# Altium schematic sheet Needle_main.SchDoc: ESP32_IMU_SPI_BOARD
size A3; Author: Alfred; CompanyName: worldangle.cn; DrawnBy: Alfred; DocumentNumber: 1; SheetNumber: 1; SheetTotal: 1
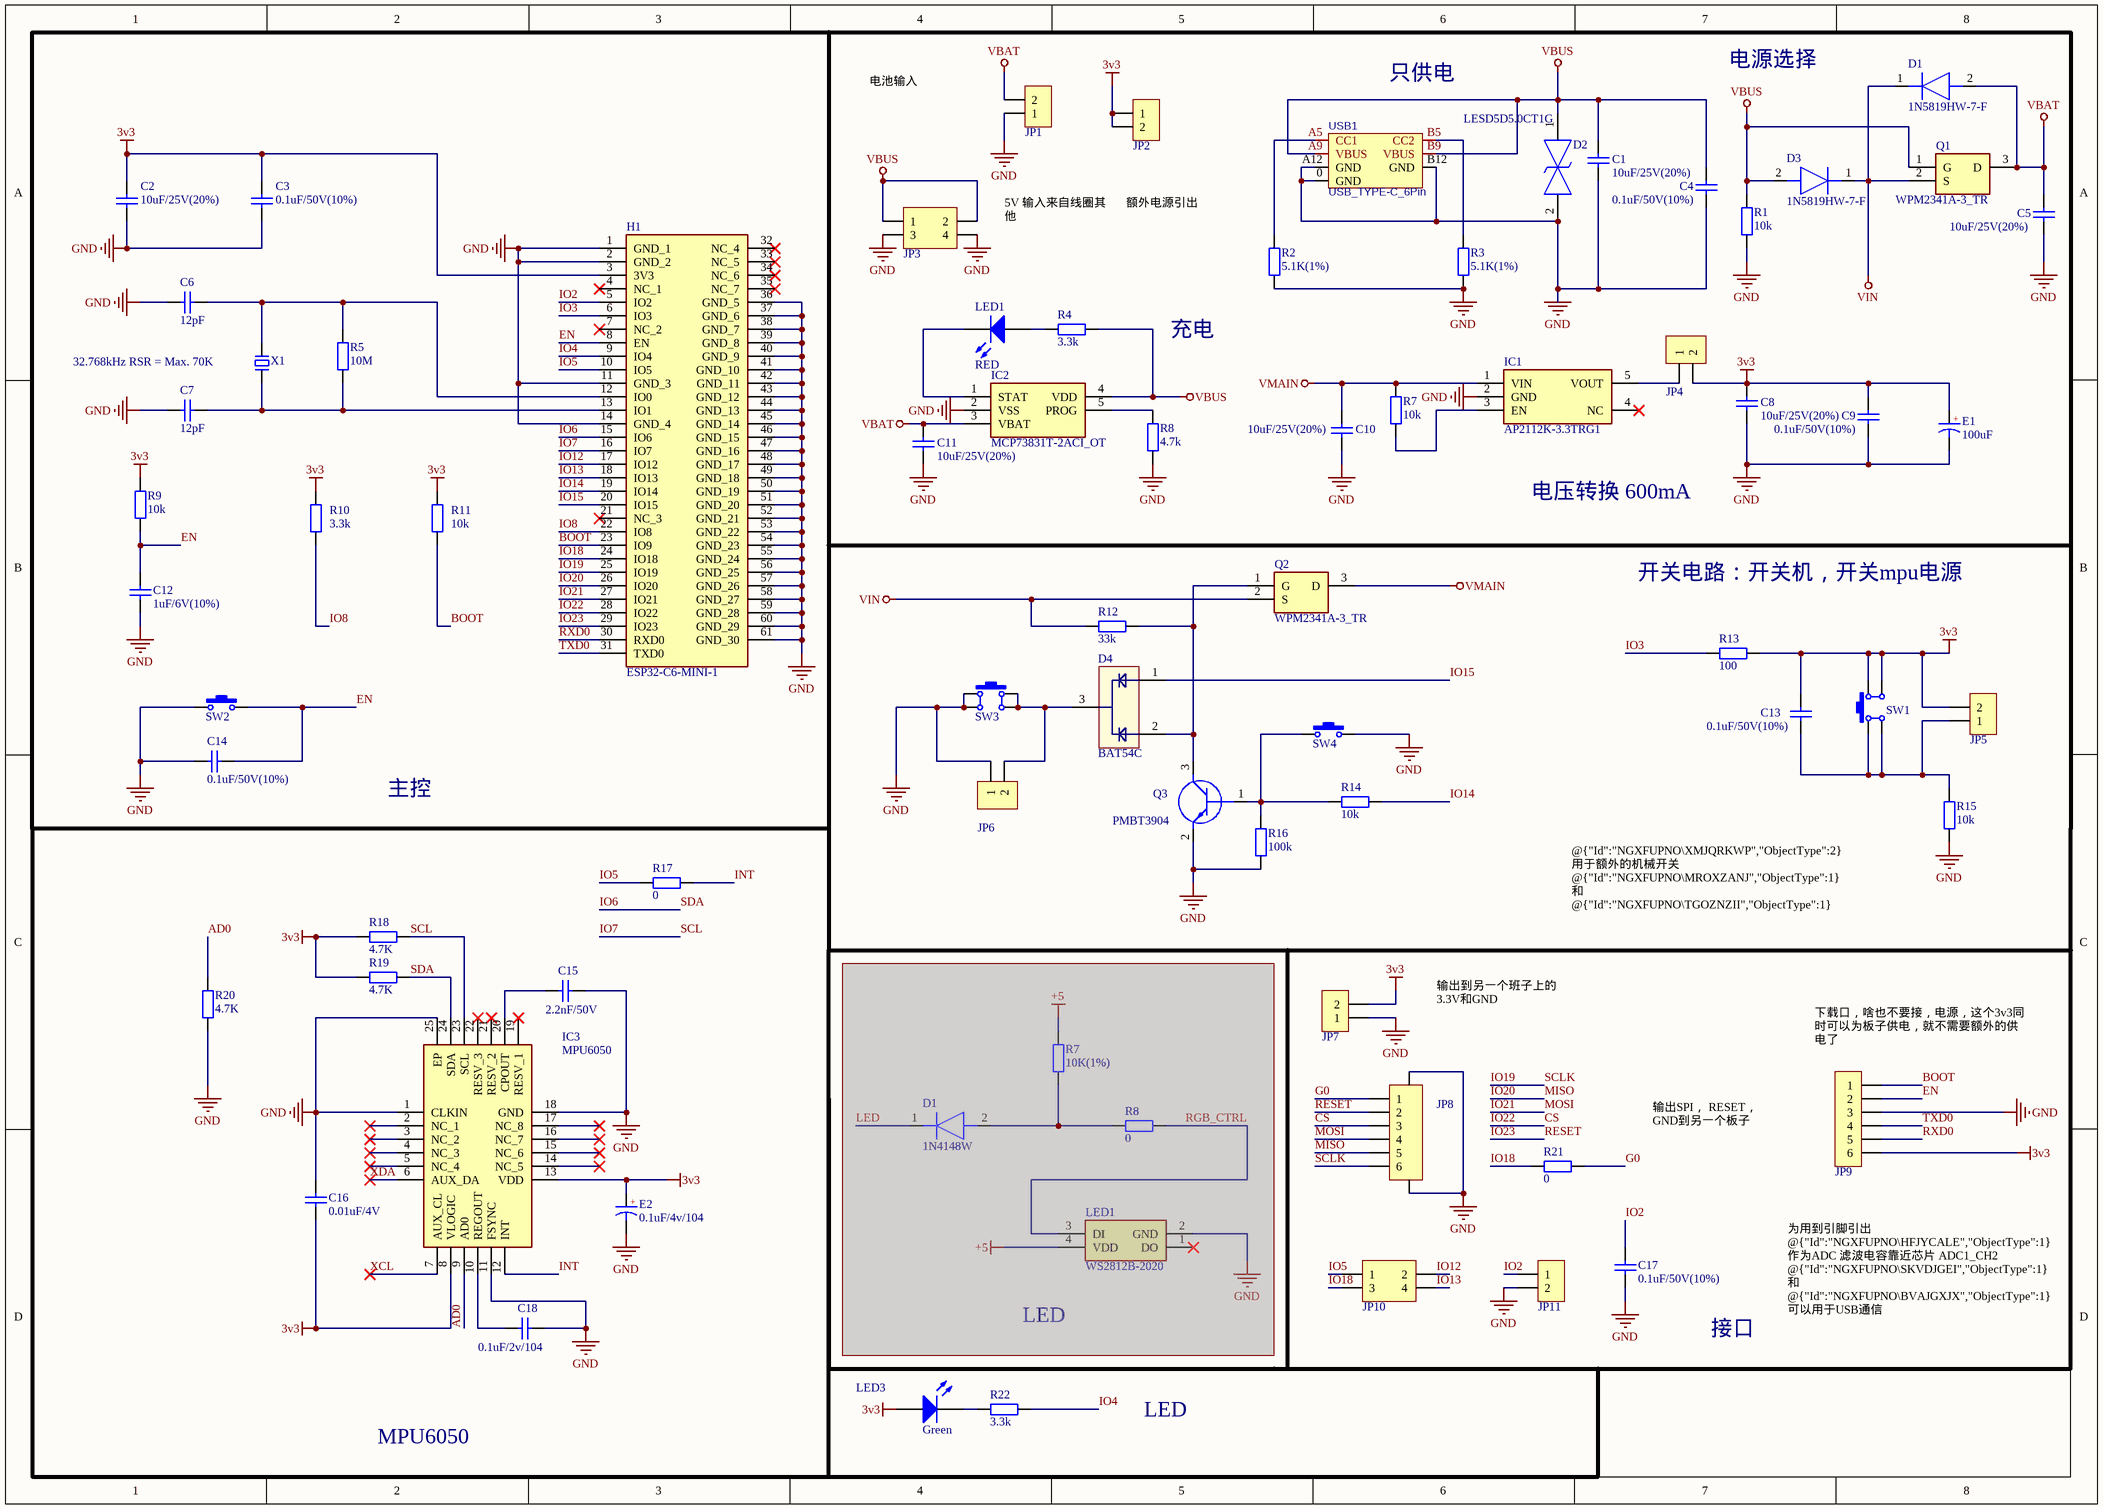
[diagram p0: Needle_main.SchDoc]

## Parts
(Parts that share a designator on the sheet are numbered #1, #2 ... from top to bottom, then left to right.)
C1  10uF/25V(20%)  [C0603_L]
C2  10uF/25V(20%)  [C0402_L]
C3  0.1uF/50V(10%)  [C0402_L]
C4  0.1uF/50V(10%)  [C0603_L]
C5  10uF/25V(20%)  [C0603_L]
C6  12pF  [C0402_L]
C7  12pF  [C0402_L]
C8  10uF/25V(20%)  [C0603_L]
C9  0.1uF/50V(10%)  [C0603_L]
C10  10uF/25V(20%)  [C0805_L]
C11  10uF/25V(20%)  [C0805_L]
C12  1uF/6V(10%)  [C0402_L]
C13  0.1uF/50V(10%)  [C0402_L]
C14  0.1uF/50V(10%)  [C0402_L]
C15  2.2nF/50V  [C0402_L]
C16  0.01uF/4V  [C0402_L]
C17  0.1uF/50V(10%)  [C0805_L]
C18  0.1uF/2v/104  [C0402_L]
D1#1  1N5819HW-7-F  [SOD3716X125N]
D1#2  1N4148W  [SOD3716X125N]  (masked out: inside a compile mask, not in the netlist)
D2  LESD5D5.0CT1G  [LESD5D50CT1G]
D3  1N5819HW-7-F  [SOD3716X125N]
D4  BAT54C  [SOT23-3N]
E1  100uF  [C_3216]
E2  0.1uF/4v/104  [C_3216]
H1  ESP32-C6-MINI-1  [ESP32C6MINI1]
IC1  AP2112K-3.3TRG1  [SOT95P285X140-5N]
IC2  MCP73831T-2ACI_OT  [SOT95P270X145-5N]
IC3  MPU6050  [MPU6050]
JP1  HDR-1X2  [PH2.0-W-2P]  (value not drawn)
JP2  HDR-1X2  [HDR2.54-LI-2P]  (value not drawn)
JP3  Header2X2  [HDR2.54-LI-2x2P]  (value not drawn)
JP4  HDR-1X2  [HDR2.54-LI-2P]  (value not drawn)
JP5  HDR-1X2  [HDR2.54-LI-2P]  (value not drawn)
JP6  HDR-1X2  [HDR2.54-LI-2P]  (value not drawn)
JP7  HDR-1X2  [PH2.0-W-2P]  (value not drawn)
JP8  CON-6P  [FPC0.5-WT-6P]  (value not drawn)
JP9  HDR-1X6  [HDR1.27-LI-6P]  (value not drawn)
JP10  Header2X2  [HDR2.54-LI-2x2P]  (value not drawn)
JP11  HDR-1X2  [HDR2.54-LI-2P]  (value not drawn)
LED1#1  RED  [LED0603_R]
LED1#2  WS2812B-2020  [WS2812B2020]  (masked out: inside a compile mask, not in the netlist)
LED3  Green  [LED0603_G]
Q1  WPM2341A-3_TR  [SOT95P237X112-3N]
Q2  WPM2341A-3_TR  [SOT95P237X112-3N]
Q3  PMBT3904  [SOT95P230X110-3N]
R1  10k  [R0402_L]
R2  5.1K(1%)  [R0402_L]
R3  5.1K(1%)  [R0402_L]
R4  3.3k  [R0402_L]
R5  10M  [R0402_L]
R7#1  10k  [R0402_L]
R7#2  10K(1%)  [R0402_L]  (masked out: inside a compile mask, not in the netlist)
R8#1  4.7k  [R0402_L]
R8#2  0  [R0402_L]  (masked out: inside a compile mask, not in the netlist)
R9  10k  [R0402_L]
R10  3.3k  [R0402_L]
R11  10k  [R0402_L]
R12  33k  [R0402_L]
R13  100  [R0402_L]
R14  10k  [R0402_L]
R15  10k  [R0402_L]
R16  100k  [R0402_L]
R17  0  [R0805_L]
R18  4.7K  [R0402_L]
R19  4.7K  [R0402_L]
R20  4.7K  [R0402_L]
R21  0  [R0805_L]
R22  3.3k  [R0402_L]
SW1  6x6x5  [SW SMD-6*6*4.3]  (value not drawn)
SW2  3x6x5  [SW SMD-3*6*2.5]  (value not drawn)
SW3  6x6x5  [SW SMD-6*6*4.3]  (value not drawn)
SW4  3x6x5  [SW SMD-3*6*2.5]  (value not drawn)
USB1  USB_TYPE-C_6Pin  [USB-C-SMD_6P]
X1  32.768kHz RSR = Max. 70K  [XTAL-3215-2P]

## Blocks framed on the sheet
主控: C2 C3 C6 C7 C12 C14 H1 R5 R9-R11 SW2 X1

## Nets
3v3: C2.2 C3.2 C8.1 C9.2 C13.2 C16.2 E1.1(A) E2.1(A) H1.3(3V3) IC3.8(VLOGIC) IC3.13(VDD) JP2.1 JP2.2 JP4.2 JP5.2 JP7.2 JP9.6 LED3.1(A) R9.1 R10.1 R11.1 R13.1 R18.1 R19.1 SW1.2 SW1.3
GND: C1.2 C2.1 C3.1 C4.1 C5.1 C6.1 C7.1 C8.2 C9.1 C10.2 C11.2 C12.1 C14.2 C15.2 C16.1 C17.2 C18.2 D2.2 E1.2(K) E2.2(K) H1.1(GND_1) H1.2(GND_2) H1.11(GND_3) H1.14(GND_4) H1.36(GND_5) H1.37(GND_6) H1.38(GND_7) H1.39(GND_8) H1.40(GND_9) H1.41(GND_10) H1.42(GND_11) H1.43(GND_12) H1.44(GND_13) H1.45(GND_14) H1.46(GND_15) H1.47(GND_16) H1.48(GND_17) H1.49(GND_18) H1.50(GND_19) H1.51(GND_20) H1.52(GND_21) H1.53(GND_22) H1.54(GND_23) H1.55(GND_24) H1.56(GND_25) H1.57(GND_26) H1.58(GND_27) H1.59(GND_28) H1.60(GND_29) H1.61(GND_30) IC1.2(GND) IC2.2(VSS) IC3.1(CLKIN) IC3.11(FSYNC) IC3.18(GND) IC3.25(EP) JP1.1 JP3.3 JP3.4 JP6.1 JP7.1 JP8.0 JP9.3 JP11.2 Q3.2(E) R1.1 R2.1 R3.1 R8#1.2 R15.2 R16.1 R20.2 SW2.1 SW3.2 SW3.3 SW4.2 USB1.0(GND) USB1.A12(GND) USB1.B12(GND)
VBAT: C5.2 C11.1 D1#1.2(A) IC2.3(VBAT) JP1.2 Q1.3(D)
VBUS: C1.1 C4.2 D2.1 D3.2(A) IC2.4(VDD) JP3.1 JP3.2 Q1.1(G) R1.2 R4.1 USB1.A9(VBUS) USB1.B9(VBUS)
VIN: D1#1.1(K) D3.1(K) Q1.2(S) Q2.2(S) R12.1
VMAIN: C10.1 IC1.1(VIN) Q2.3(D) R7#1.2
AD0: IC3.9(AD0) R20.1
BOOT: H1.23(IO9) JP9.1 R11.2
CS: H1.28(IO22) JP8.3  [also labelled IO22]
EN: C12.2 C14.1 H1.8(EN) JP9.2 R9.2 SW2.2
G0: JP8.1 R21.1
INT: IC3.12(INT) R17.1
IO2: C17.1 H1.5(IO2) JP11.1
IO3: H1.6(IO3) R13.2
IO4: H1.9(IO4) R22.1
IO5: H1.10(IO5) JP10.1 R17.2
IO6: H1.15(IO6) IC3.24(SDA) R19.2  [also labelled SDA]
IO7: H1.16(IO7) IC3.23(SCL) R18.2  [also labelled SCL]
IO8: H1.22(IO8) R10.2
IO12: H1.17(IO12) JP10.2
IO13: H1.18(IO13) JP10.4
IO14: H1.19(IO14) R14.2
IO15: D4.1 H1.20(IO15)
IO18: H1.24(IO18) JP10.3 R21.2
IO19: H1.25(IO19) JP8.6  [also labelled SCLK]
IO20: H1.26(IO20) JP8.5  [also labelled MISO]
IO21: H1.27(IO21) JP8.4  [also labelled MOSI]
IO23: H1.29(IO23) JP8.2  [also labelled RESET]
RXD0: H1.30(RXD0) JP9.5
TXD0: H1.31(TXD0) JP9.4
XCL: IC3.7(AUX_CL)
XDA: IC3.6(AUX_DA)
NetC6_2: C6.2 H1.12(IO0) R5.2 X1.2
NetC7_2: C7.2 H1.13(IO1) R5.1 X1.1
NetC13_1: C13.1 JP5.1 R15.1 SW1.1 SW1.4
NetC15_1: C15.1 IC3.20(CPOUT)
NetC18_1: C18.1 IC3.10(REGOUT)
NetD4_2: D4.2 Q2.1(G) Q3.3(C) R12.2
NetD4_3: D4.3 JP6.2 SW3.1 SW3.4
NetIC1_3: IC1.3(EN) R7#1.1
NetIC1_5: IC1.5(VOUT) JP4.1
NetIC2_1: IC2.1(STAT) LED1#1.2(K)
NetIC2_5: IC2.5(PROG) R8#1.1
NetLED1#1_1: LED1#1.1(A) R4.2
NetLED3_2: LED3.2(K) R22.2
NetQ3_1: Q3.1(B) R14.1 R16.2 SW4.1
NetR2_2: R2.2 USB1.A5(CC1)
NetR3_2: R3.2 USB1.B5(CC2)

Not connected (* = marked no-connect by the designer): H1 4(NC_1)* 7(NC_2)* 21(NC_3)* 32(NC_4)* 33(NC_5)* 34(NC_6)* 35(NC_7)*; IC1 4(NC)*; IC3 2(NC_1)* 3(NC_2)* 4(NC_3)* 5(NC_4)* 14(NC_5)* 15(NC_6)* 16(NC_7)* 17(NC_8)* 19(RESV_1)* 21(RESV_2)* 22(RESV_3)*

## Notes on the sheet
- 只供电
- 电源选择
- 电池输入
- 5V 输入来自线圈其他
- (near R2) 额外电源引出
- 充电
- 电压转换 600mA
- 开关电路：开关机，开关mpu电源
- @{"Id":"NGXFUPNO\XMJQRKWP","ObjectType":2} 用于额外的机械开关
  @{"Id":"NGXFUPNO\MROXZANJ","ObjectType":1} 和 @{"Id":"NGXFUPNO\TGOZNZII","ObjectType":1}
  拉高 @{"Id":"NGXFUPNO\XUJUERAL","ObjectType":1} 打开电源，拉低关闭电源，也添加了大孔，方便直接拉高
- (near JP8) 输出到另一个班子上的3.3V和GND
- (near JP9) 下载口，啥也不要接，电源，这个3v3同时可以为板子供电，就不需要额外的供电了
- 输出SPI， RESET， GND到另一个板子
- LED
- 接口
- 为用到引脚引出
  @{"Id":"NGXFUPNO\HFJYCALE","ObjectType":1}作为ADC 滤波电容靠近芯片 ADC1_CH2
  @{"Id":"NGXFUPNO\SKVDJGEI","ObjectType":1} 和 @{"Id":"NGXFUPNO\BVAJGXJX","ObjectType":1} 可以用于USB通信
  @{"Id":"NGXFUPNO\YITHCUNO","ObjectType":1} 和 @{"Id":"NGXFUPNO\OJPLEHPR","ObjectType":1} 将现有中断引出，支持外部中断
- MPU6050
- (in symbol CT) +

## Library data of the parts
C1-C18 = C: 贴片电容/MLCC电容; BOM名称: 无极性贴片电容; 联系下单店铺卖家 免费帮你查找封装: 联系下单店铺卖家 免费技术指导; 当前库版本V2024.2.3 @淘宝卖家:黄晶宝石: 最新版本发布https://item.taobao.com/item.htm?id=566775463719
D1#1 D3 = 1N5819HW-7-F: Diode; Manufacturer_Name: Multicomp Pro; Datasheet Link: http://www.farnell.com/datasheets/1693720.pdf; Height: 1.25mm; Manufacturer_Part_Number: 1N5819HW-7-F
D1#2 = 1N4148W: Diode; Manufacturer_Name: Rectron; Datasheet Link: https://www.rectron.com/public/product_datasheets/1n4148w.pdf; Height: 1.25mm; Manufacturer_Part_Number: 1N4148W; Mouser Part Number: 583-1N4148W; Mouser Price/Stock: https://www.mouser.co.uk/ProductDetail/Rectron/1N4148W?qs=rrS6PyfT74dlwuw0ST2zKA%3D%3D; Arrow Part Number: 1N4148W; Arrow Price/Stock: https://www.arrow.com/en/products/1n4148w/rectron?region=nac
D2 = LESD5D5.0CT1G: TVS Diode (Bi-directional); Manufacturer_Name: LRC; Height: 0.7mm; Manufacturer_Part_Number: LESD5D5.0CT1G
D4 = BAT54C: 两路肖特基二极管; 当前库版本V2024.2.3 @淘宝卖家:黄晶宝石: 最新版本发布https://item.taobao.com/item.htm?id=566775463719
E1 E2 = CT: 贴片钽电容; 联系下单店铺卖家 免费帮你查找封装: 联系下单店铺卖家 免费技术指导; BOM名称: 贴片钽电容
H1 = ESP32-C6-MINI-1: Hardware; Manufacturer_Name: Espressif Systems; Datasheet Link: https://www.espressif.com/sites/default/files/documentation/esp32-c6-mini-1_datasheet_en.pdf; Height: 2.55mm; Manufacturer_Part_Number: ESP32-C6-MINI-1
IC1 = AP2112K-3.3TRG1: Integrated Circuit; Manufacturer_Name: Diodes Incorporated; Datasheet Link: https://www.diodes.com//assets/Datasheets/AP2112.pdf; Height: 1.4mm; Manufacturer_Part_Number: AP2112K-3.3TRG1; Mouser Part Number: 621-AP2112K-3.3TRG1; Mouser Price/Stock: https://www.mouser.co.uk/ProductDetail/Diodes-Incorporated/AP2112K-3.3TRG1?qs=x6A8l6qLYDDPYHosCdzh%2FA%3D%3D; Arrow Part Number: AP2112K-3.3TRG1; Arrow Price/Stock: https://www.arrow.com/en/products/ap2112k-3.3trg1/diodes-incorporated?region=asia
IC2 = MCP73831T-2ACI_OT: Integrated Circuit; Manufacturer_Name: Microchip; Manufacturer_Part_Number: MCP73831T-2ACI/OT; Datasheet Link: http://ww1.microchip.com/downloads/en/DeviceDoc/20001984g.pdf; Height: 1.45mm; Mouser Part Number: 579-MCP73831T-2ACIOT; Mouser Price/Stock: https://www.mouser.co.uk/ProductDetail/Microchip-Technology/MCP73831T-2ACI-OT?qs=yUQqVecv4qvbBQBGbHx0Mw%3D%3D; Arrow Part Number: MCP73831T-2ACI/OT; Arrow Price/Stock: https://www.arrow.com/en/products/mcp73831t-2aciot/microchip-technology?region=nac
IC3 = MPU6050: Integrated Circuit; Manufacturer_Name: TDK; Datasheet Link: https://invensense.tdk.com/wp-content/uploads/2015/02/MPU-6000-Datasheet1.pdf; Height: 0.95mm; Manufacturer_Part_Number: MPU6050
JP1 JP7 = Header 2: 2P接插件; 封装库来自淘宝卖家：黄晶宝石: 获取最新版本https://shop463601444.taobao.com; 联系下单店铺卖家 免费帮你查找封装: 联系下单店铺卖家 免费技术支持; BOM名称: 2P接插件
JP2 JP4-JP6 JP11 = Header 2: 2P接插件; 联系卖家，免费查找封装: 唯一出售店铺网址https://shop463601444.taobao.com; 封装库来自淘宝卖家ID：黄晶宝石: 其他店铺购入均为盗版封装库，请立即申请退款，本店现金奖励50~200元; BOM名称: 2P接插件
JP3 JP10 = Header 2X2: 2*2P接插件; 联系卖家，免费查找封装: 唯一出售店铺网址https://shop463601444.taobao.com; 封装库来自淘宝卖家ID：黄晶宝石: 其他店铺购入均为盗版封装库，请立即申请退款，本店现金奖励50~200元; BOM名称: 2*2P接插件
JP8 = Header 6: 6P连接器; 封装库来自淘宝卖家: 黄晶宝石: 最新版本发布https://shop463601444.taobao.com; BOM名称: 6P连接器
JP9 = Header 6: 6P接插件; 联系卖家，免费查找封装: 唯一出售店铺网址https://shop463601444.taobao.com; 封装库来自淘宝卖家ID：黄晶宝石: 其他店铺购入均为盗版封装库，请立即申请退款，本店现金奖励50~200元; BOM名称: 6P接插件
LED1#1 LED3 = LED: 贴片LED; 封装库来自淘宝卖家：黄晶宝石: 其他店铺购入均为盗版封装库，无更新权益，请立即申请退款，本店现金奖励200~1000元; BOM名称: 贴片LED
LED1#2 = WS2812B-2020: LED (Multiple); Manufacturer_Name: Worldsemi; Datasheet Link: https://www.alldatasheet.com/datasheet-pdf/pdf/1134522/WORLDSEMI/WS2812B-2020.html; Height: 0.84mm; Manufacturer_Part_Number: WS2812B-2020
Q1 Q2 = WPM2341A-3_TR: Transistor; Manufacturer_Name: Will Semiconductor; Manufacturer_Part_Number: WPM2341A-3/TR; Datasheet Link: https://pdf1.alldatasheet.com/datasheet-pdf/view/1232042/VBSEMI/WPM2341A-3/TR.html; Height: 1.12mm
Q3 = PMBT3904: Transistor BJT NPN; Manufacturer_Name: NXP; Datasheet Link: https://assets.nexperia.com/documents/data-sheet/PMBT3904.pdf; Height: 1.1mm; Manufacturer_Part_Number: PMBT3904; Mouser Part Number: N/A; Mouser Price/Stock: https://www.mouser.co.uk/ProductDetail/NXP-Semiconductors/PMBT3904?qs=55YtniHzbhAIamwsj%252B6ewg%3D%3D
R1-R5 R7#1 R7#2 R8#1 R8#2 R9-R21 = R: 贴片电阻; 联系下单店铺卖家 免费帮你查找封装: 联系下单店铺卖家 免费技术指导; BOM名称: 贴片电阻
R22 = R: 电阻类型:厚膜电阻;阻值:0Ω;精度:±1%;功率:62.5mW;; BOM名称: 贴片电阻; 联系下单店铺卖家 免费帮你查找封装: 联系下单店铺卖家 免费技术指导
SW1 SW3 = SW SMD-6x6: TS-1002S-05026C 贴片6x6轻触开关; 联系下单店铺卖家 免费技术支持: 联系下单店铺卖家 免费帮你查找封装; BOM名称: 贴片6x6轻触开关
SW2 SW4 = SW 3x6: 3x6轻触开关; 联系下单店铺卖家 免费技术支持: 联系下单店铺卖家 免费帮你查找封装; BOM名称: 3x6轻触开关
USB1 = USB_TYPE-C_6Pin: USB_TYPE-C_6Pin母座; 联系下单店铺卖家 免费技术支持: 联系下单店铺卖家 免费帮你查找封装; 当前库版本V2024.2.3 @淘宝卖家:黄晶宝石: 最新版本发布https://item.taobao.com/item.htm?id=566775463719
X1 = XTAL-2P: 2脚无源晶振(谐振器）; 联系下单店铺卖家 免费帮你查找封装: 联系下单店铺卖家 免费技术指导; BOM名称: 2脚无源晶振(谐振器）